# Altium schematic sheet PiTopConn.SchDoc
size A4
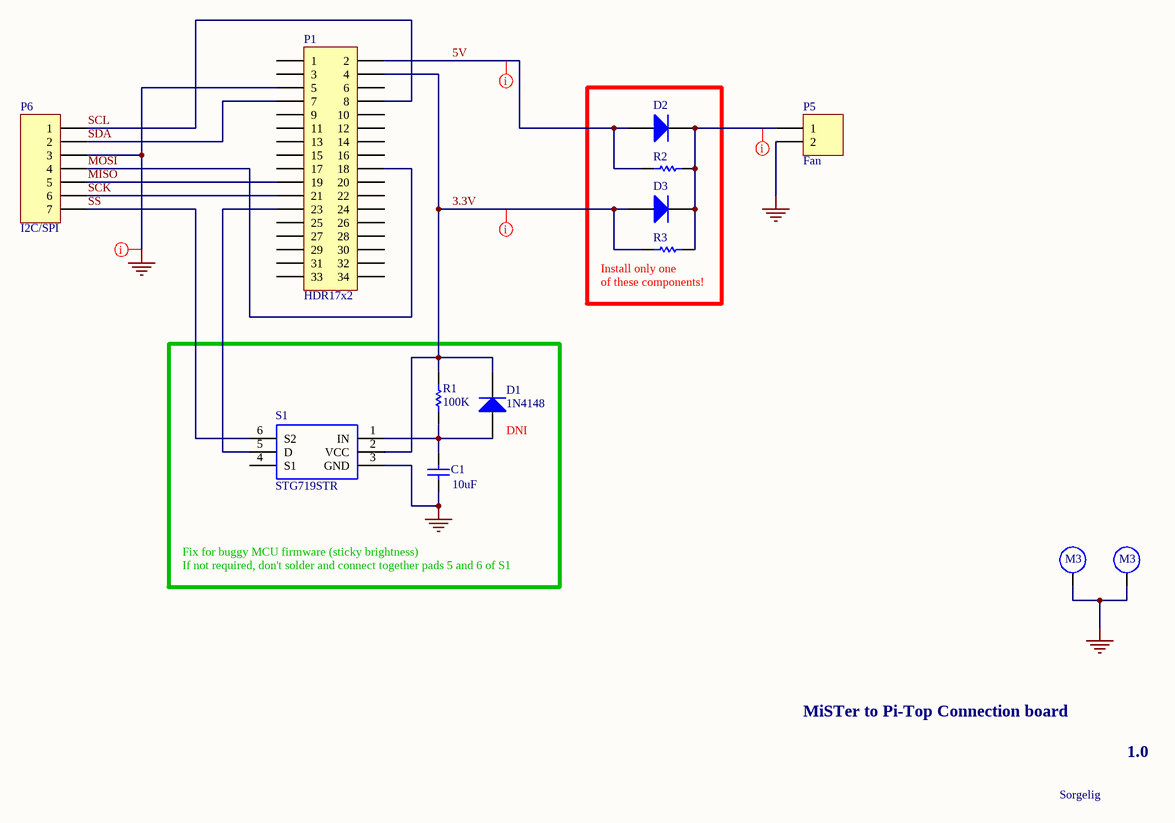
[diagram p0: PiTopConn.SchDoc]

## Parts
C1  value 10uF  [C0805]  (hidden comment: C0805)
D1  1N4148  [DIODE]
D2  Diode  [DIODE]  (value not drawn)
D3  Diode  [DIODE]  (value not drawn)
H1  M3  [M3]  (value not drawn)
H2  M3  [M3]  (value not drawn)
P1  HDR17x2  [HDR17X2_90]
P5  Fan  [HDR1X2]
P6  I2C/SPI  [HDR1X7]
R1  100K  [R0805]
R2  10  [6-0805]  (value not drawn)
R3  10  [6-0805]  (value not drawn)
S1  STG719STR  [SOT23-6_L]

## Nets
GND: C1.1 H1.1 H2.1 P1.5 P5.2 P6.3 S1.3(GND)
3.3V: D1.2(K) D3.1(A) P1.4 R1.2 R3.1 S1.2(VCC)
5V: D2.1(A) P1.2 R2.1
MISO: P1.19 P6.5
MOSI: P1.18 P6.4
SCK: P1.21 P6.6
SCL: P1.8 P6.1
SDA: P1.7 P6.2
SS: P6.7 S1.6(S2)
NetC1_2: C1.2 D1.1(A) R1.1 S1.1(IN)
NetD2_2: D2.2(K) D3.2(K) P5.1 R2.2 R3.2
NetP1_23: P1.23 S1.5(D)

Not connected (* = marked no-connect by the designer): P1 1 3 6 9 10 11 12 13 14 15 16 17 20 22 24 25 26 27 28 29 30 31 32 33 34; S1 4(S1)

## Layout directives
net class power: 3.3V, 5V, GND, NetD2_2

## Notes on the sheet
- (near R3) Install only one
- (near R3) of these components!
- (near D1) DNI
- Fix for buggy MCU firmware (sticky brightness)
- If not required, don't solder and connect together pads 5 and 6 of S1
- MiSTer to Pi-Top Connection board
- 1.0
- Sorgelig

## Library data of the parts
C1 = C0805: Ceramic Chip Capacitor - Standard; Note: Footprint corresponds to dimensions for bulk cassette packaging. This case size has tightened tolerances.; Published: 17-Jul-2002; LatestRevisionDate: 19-Mar-2004; LatestRevisionNote: Silkscreen size reduced.; DatasheetDocument: Mar-2001; PackageDocument: Mar-2001; PackageReference: 0805; Publisher: Altium Limited; Code_JEITA: 0805; Code_IPC: 2012[0805]; ComponentLink1Description: Manufacturer Link; ComponentLink1URL: http://www.kemet.com/; ComponentLink2Description: Datasheet; ComponentLink2URL: http://www.kemet.com/kemet/web/homepage/kechome.nsf/vapubfilesname/F3102TA.pdf/$file/F3102TA.pdf
D1-D3 = Diode: Default Diode; Published: 8-Jun-2000; LatestRevisionDate: 17-Jul-2002; LatestRevisionNote: Re-released for DXP Platform.; PackageVersion: Sep-1996; PackageReference: SMC; Publisher: Altium Limited; PackageDescription: DO-214-AB/SMC; 2 C-Bend Leads; Body 7.9 x 5.9 mm, inc. leads (LxW); Code_JEDEC: DO-214-AB
P5 = Header 2: Header, 2-Pin; LatestRevisionDate: 17-Jul-2002; LatestRevisionNote: Re-released for DXP Platform.; Publisher: Altium Limited
P6 = Header 7: Header, 7-Pin; LatestRevisionDate: 17-Jul-2002; LatestRevisionNote: Re-released for DXP Platform.; Publisher: Altium Limited
R1-R3 = ERJ6RS: Low Ohmic Value Thick Film Chip Resistor, 0.1 Ohm to 0.2 Ohm Range, 1%, 2% and 5% Tolerance, 0805 Size, 0.125 W; Published: 17-Dec-2003; LatestRevisionDate: 19-Mar-2004; LatestRevisionNote: Silkscreen size reduced.; PackageDocument: Mar-2003; PackageReference: 6-0805; Publisher: Altium Limited; Code_IPC: 2012 [0805]; ComponentLink1Description: Manufacturer Link; ComponentLink1URL: http://www.panasonic.com/industrial/components/resistive_products.htm; ComponentLink2Description: Datasheet; ComponentLink2URL: http://www.panasonic.com/industrial/components/pdf/AOA0000CE3.pdf
S1 = STG719STR: STMICROELECTRONICS - STG719STR - IC, SWITCH, SPDT, SMD; Geometry.Height: 1.45mm; Supplier_Name: RS; RS Part Number: *; Manufacturer_Name: STMicroelectronics; Manufacturer_Part_Number: STG719STR; Allied_Number: *; Other Part Number: *; Datasheet Link: http://www.st.com/content/ccc/resource/technical/document/datasheet/10/33/73/59/23/59/49/0b/CD00002039.pdf/files/CD00002039.pdf/jcr:content/translations/en.CD00002039.pdf; 3D Package: *